# EAGLE design Adafruit MLX90393 Wide Range Magnetometer (EAGLE 9.2.0)
COMPANY: ADAFRUIT INDUSTRIES; DRAWN: KTOWN; REV: C; YEAR: 2019
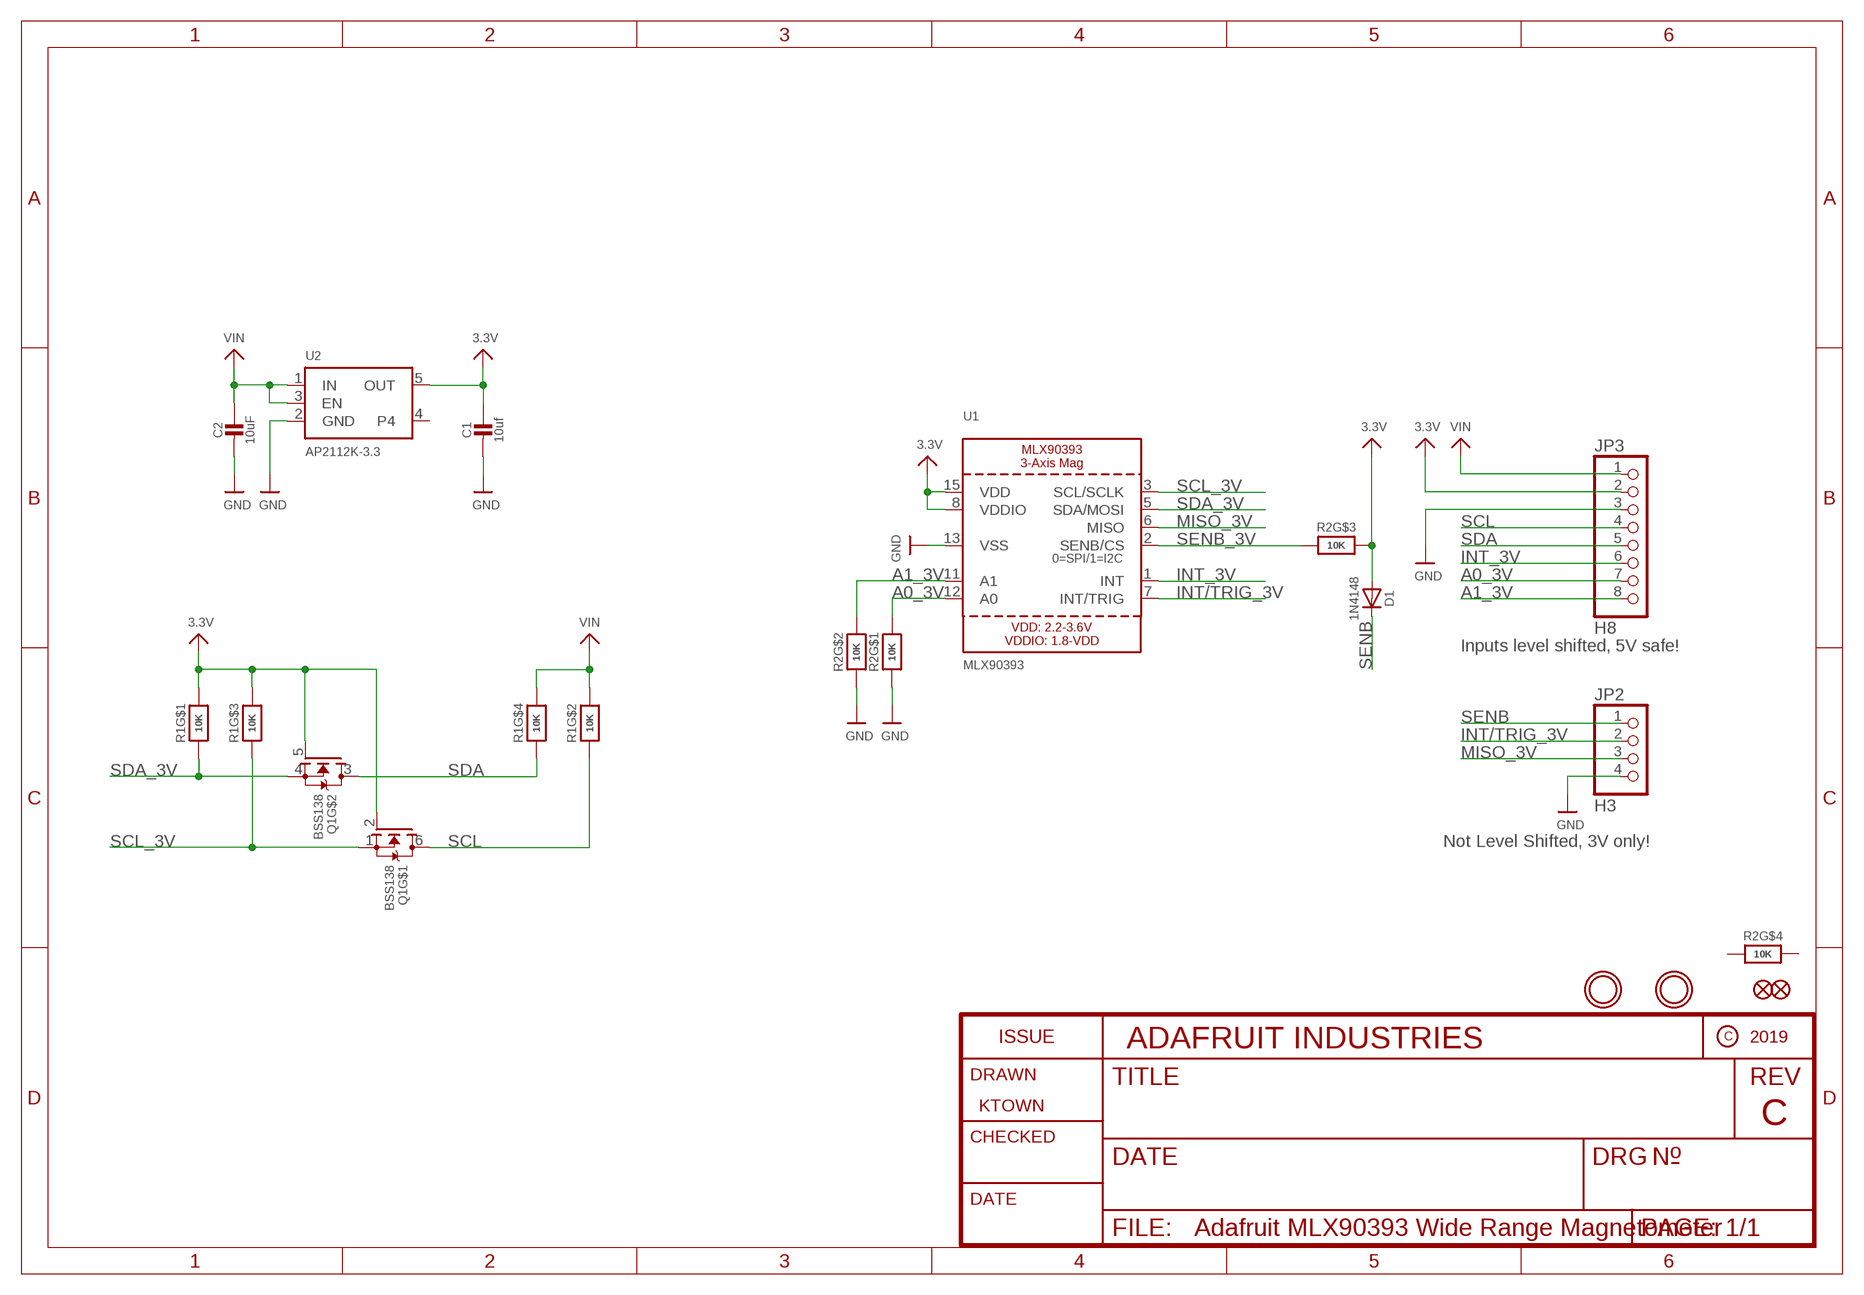
[diagram p0: schematic, sheet 1]

## Parts
C1  10uf  CAP_CERAMIC0805_10MGAP  [0805_10MGAP]
C2  10uF  CAP_CERAMIC0805_10MGAP  [0805_10MGAP]
D1  1N4148  DIODESOD-323  [SOD-323]
FID1  FIDUCIAL_1MM  [FIDUCIAL_1MM]
FID3  FIDUCIAL_1MM  [FIDUCIAL_1MM]
JP2  H3  HEADER-1X4ROUND  [1X04_ROUND]
JP3  H8  HEADER-1X8ROUND  [1X08_ROUND]
Q1  BSS138  MOSFET-N_DUAL  [SOT363]
R1  10K  RESISTOR_4PACK_NO  [RESPACK_4X0603_NO]
R2  10K  RESISTOR_4PACK_NO  [RESPACK_4X0603_NO]
U1  MLX90393  [QFN16_3MM]
U2  AP2112K-3.3  VREG_SOT23-5  [SOT23-5]
U$19  MOUNTINGHOLE2.5  [MOUNTINGHOLE_2.5_PLATED]
U$23  MOUNTINGHOLE2.5  [MOUNTINGHOLE_2.5_PLATED]

## Nets
3.3V: C1.1 D1.A JP3.2 Q1.2(G) Q1.5(G) R1.6 R1.8 R2.6 U1.8(VDDIO) U1.15(VDD) U2.5(OUT)
A0_3V: JP3.7 R2.8 U1.12(A0)
A1_3V: JP3.8 R2.7 U1.11(A1)
GND: C1.2 C2.2 JP2.4 JP3.3 R2.1 R2.2 U1.13(VSS) U2.2(GND)
INT/TRIG_3V: JP2.2 U1.7(INT/TRIG)
INT_3V: JP3.6 U1.1(INT)
MISO_3V: JP2.3 U1.6(MISO)
SCL: JP3.4 Q1.6(D) R1.2
SCL_3V: Q1.1(S) R1.3 U1.3(SCL/SCLK)
SDA: JP3.5 Q1.3(D) R1.4
SDA_3V: Q1.4(S) R1.1 U1.5(SDA/MOSI)
SENB: D1.C JP2.1
SENB_3V: R2.3 U1.2(SENB/CS)
VIN: C2.1 JP3.1 R1.5 R1.7 U2.1(IN) U2.3(EN)
Unconnected: R2.4 R2.5 U2.4

## Notes on the sheet
- Inputs level shifted, 5V safe!
- Not Level Shifted, 3V only!

## Library data of the parts
C1 C2 = microbuilder:CAP_CERAMIC: Ceramic Capacitors For new designs, use the packages preceded by an '_' character since they are more reliable: The following footprints should be used on most boards: _0402 - Standard footprint for regular board layouts _0603 - Standard footprint for regular board layouts _0805 - Standard footprint for regular board layouts _1206 - Standard footprint for regular board layouts For extremely tight-pitch boards where space is at a premium, the following 'micro-pitch' footprints can be used (smaller pads, no silkscreen outline, etc.): _0402MP - Micro-pitch footprint for very dense/compact boards _0603MP - Micro-pitch footprint for very dense/compact boards _0805MP - Micro-pitch footprint for very dense/compact boards _1206MP - Micro-pitch footprint for very dense/compact boards
D1 = microbuilder:DIODE: Diode SMA Model Volts Amps Type Vf Ir Digikey # Notes SSA34-E3 40V 3A Schottky 480mV @ 3A 200uA @ 40V SSA34-E3/61TGITR-ND CDBA120-G 20V 1A Schottky 500mV @ 1A 500uA @ 20V 641-1014-6-ND REEL MBRA210 10V 2A Schottky 350mV @ 2A 700uA @ 10V MBRA210LT3 SOD-123 Model Volts Amps Type Vf Ir Order # Notes BAT54T1G 30V 200mA Schottky 800mV @ 200mA 2uA @ 25V BAT54T1GOSTR-ND B0530W 30V 500mA Schottky 430mV @ 500mA 130uA @ 30V B0530W-FDICT-ND REEL MBR120 20V 1A Schottky 340mV @ 1A MBR120VLSFT1GOSCT-ND SOD-323 Model Volts Amps Type Vf Ir Order # Notes PMEG2005EJ 20V 500mA Schottky 355mV @ 500mA 568-4110-1-ND ZLLS410 10V 570mA Schottky 380mV @ 570mA ZLLS410CT-ND 1N4148WS 75V 150mA Silicon/Simple 1V 1N4148WSFSCT-ND REEL SOD-523 Model Volts Amps Type Vf Ir Order # Notes BAT54XV2 30V 200mA Schottky 0.8V @ 100mA BAT54XV2CT-ND TB751S 30V 30mA Schottky RB751S-40TE61CT-ND SOT23-R/W (R = Solder Paste/Reflow Ovens, W = Hand-Soldering) Model Volts Amps Type Vf Ir Order # Notes BAT54FILM 40V 300mA Schottky 497-7162-1-ND POWERDI-5 Model Volts Amps Type Vf Ir Order # Notes PDS560 60V 5A Schottky 670mV @ 5A 150uA @ 60V PDS560DICT-ND
FID1 FID3 = microbuilder:FIDUCIAL: Fiducial Alignment Points Various fiducial points for machine vision alignment.; BOM: EXCLUDE
JP2 = microbuilder:HEADER-1X4: PIN HEADER
JP3 = microbuilder:HEADER-1X8: PIN HEADER
Q1 = microbuilder:MOSFET-N_DUAL: Dual N-Channel MOSFET SOT363 (2.0x1.25mm) 2N7002PS - 60V, 320mA [Digikey: 568-5984-1-ND]
R1 R2 = microbuilder:RESISTOR_4PACK: Resistor Packs (4 resistors) 4 x 0603 10K 1/16W - Digikey: YC164J-10KCT-ND
U1 = microbuilder:MLX90393: MLX90393 - Wide Range 3 Axis Magnetometer
U2 = microbuilder:VREG_SOT23-5: SOT23-5 Fixed Voltage Regulators Part Current Out V Out V In V Dropout θJA (°C/W) TJ (°C) Digikey Part No. ADP121 150mA 3.3V 3.4-5.5V 0.09V @ 150mA -- -- ADP121-AUJZ33R7CT-ND ADP121 150mA 3.0V 3.1-5.5V 0.09V @ 150mA -- -- ADP121-AUJZ30R7CT-ND ADP122 300mA 3.3V 3.4-5.5V 0.085V @ 300mA -- -- ADP122AUJZ-3.3-R7CT-ND ADP1712 300mA 3.3V 3.5-5.5V 0.17V @ 300mA -- -- ADP1712AUJZ-3.3-R7TR-ND AP7311 (Low Cost) 150mA 3.3V 3.5-6V 0.15V @ 150mA -- -- AP7311-33WG-7DICT-ND LD39015M18R 150mA 1.8V 1.9V-5.5V 0.08V @ 100mA -- -- 497-6977-1-ND LP2985A-33DBVR 150mA 3.3V 3.3-16V 0.28V @ 150mA 206 150 296-18479-1-ND MCP1824T-3302E/OT 300mA 3.3V 3.5V-6V 0.2V @ 300mA -- -- MCP1824T-3302E/OTCT-ND MIC5205-2.5YM5 TR 150mA 2.5V 2.7-16V 0.165V @ 150mA -- -- 576-1257-2-ND MIC5205-3.0YM5 TR 150mA 3.0V 3.2V-16V 0.165V @ 150mA -- -- 576-1258-2-ND MIC5205-3.3YM5 TR 150mA 3.3V 3.5V-16V 0.165V @ 150mA -- -- 576-1259-2-ND TPS780330220 150mA 3.3V+2.2V 3.6-5.5V 250mV Max -- -- 296-23332-1-ND TDA3663/N1,135 100mA 3.3V 3.5-45V 0.18V @ 50mA -- -- 568-5343-1-ND Max operating temp can be calculated using θJA, TJ (max junction temperature), and power in watts. Set the "Maximum Ambient Temperature" until it reaches TJ ("Max Junction Temperature"), which is the absolute limit for safe use of the regulator: Heat Sink Temperature Calculator <http://www.daycounter.com/Calculators/Heat-Sink-Temperature-Calculator.phtml> For example, With 12V source into a 3.3V LP2985 and a 30mA load, we are dissipating (12V-3.3V) * 0.03A = 0.261W. With a θJA of 206 °C/W, a TJ of 150°C, and 261mW we can safely use the chip without a heat sink up to 75°C (=147.1°C Junction Temperature).
U$19 U$23 = microbuilder:MOUNTINGHOLE: Mounting Hole For #2 screws (0.086"/2.18mm width, 0.094"/2.4mm hole) use 2.5mm; BOM: EXCLUDE

## Board
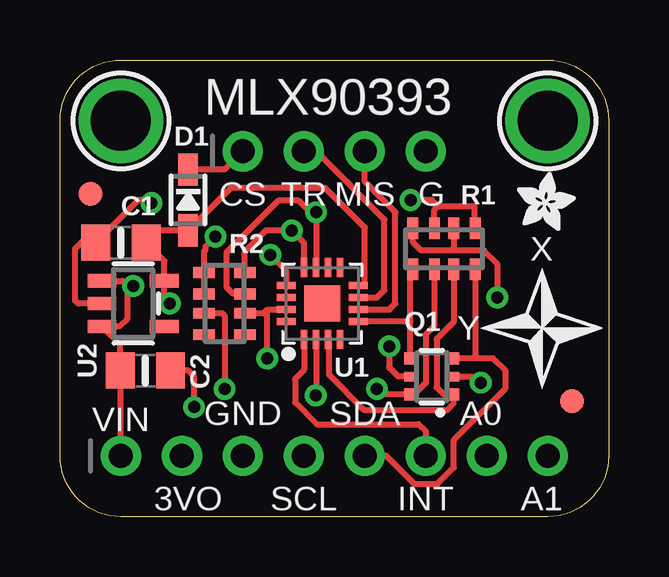
[diagram p1: board, top side]
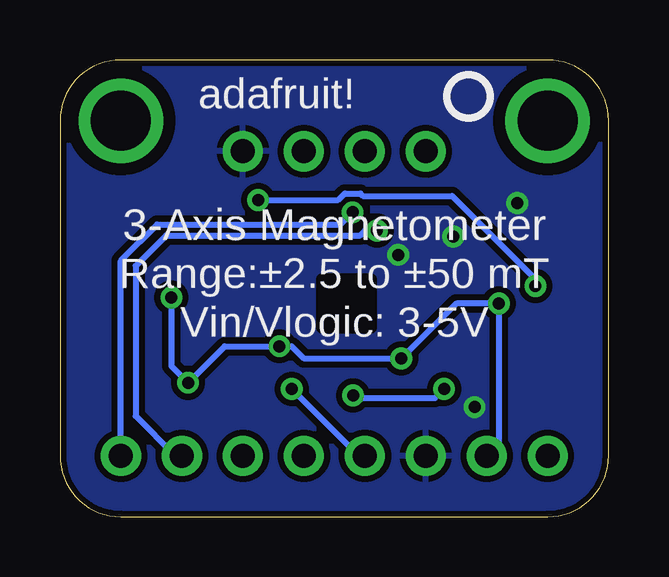
[diagram p2: board, bottom side, seen from below]

Size 22.86 x 19.05 mm. Coordinates in mm from the lower left corner, seen from the top.
Outline: 0,2.54 0,16.51 arc-90 2.54,19.05 20.32,19.05 arc-90 22.86,16.51 22.86,2.54 arc-90 20.32,0 2.54,0 arc-90 0,2.54
Copper layers (1*16): Top 0.035mm / dielectric 1.5mm / Bottom 0.035mm
Design rules "adafruit": minimum track width 8mil, minimum drill 15.5mil, track to track 8mil, track to pad 8mil, pad to pad 8mil, via to via 8mil, smd to smd 8mil, copper to edge 10mil, drill to drill 8mil, minimum pad ring 10mil, minimum via ring 8mil, stop-mask expansion 2mil, vias tented up to drill 20mil, thermal gap 10mil
tRestrict: area 9.9,7.9 to 11.9,9.9
bRestrict: area 9.9,7.9 to 11.9,9.9

### Footprints (pad centres in the part's own frame; a part is rotated, then mirrored left to right if it is on the bottom)
0805_10MGAP = smd 1.2 x 1.5: 1 -1.05,0; 2 1.05,0
SOD-323 = smd 1.35 x 0.8: A 1.27,0; C -1.27,0
FIDUCIAL_1MM = smd 1 x 1: 1 0,0
1X04_ROUND = drill 1 pad 1.676: 1 -3.81,0; 2 -1.27,0; 3 1.27,0; 4 3.81,0
1X08_ROUND = drill 1 pad 1.676: 1 -8.89,0; 2 -6.35,0; 3 -3.81,0; 4 -1.27,0; 5 1.27,0; 6 3.81,0; 7 6.35,0; 8 8.89,0
SOT363 = smd 0.5 x 0.5: 1 -0.75,-0.9; 3 0.75,-0.9; 4 0.75,0.9; 6 -0.75,0.9 | smd 0.4 x 0.5: 2 0,-0.9; 5 0,0.9
RESPACK_4X0603_NO = smd 0.45 x 0.9: 1 -1.3,-0.85; 2 -0.4,-0.85; 3 0.4,-0.85; 4 1.3,-0.85; 5 1.3,0.85; 6 0.4,0.85; 7 -0.4,0.85; 8 -1.3,0.85
QFN16_3MM = smd 0.8 x 0.28: 1 -1.5,0.75; 2 -1.5,0.25; 3 -1.5,-0.25; 4 -1.5,-0.75; 9 1.5,-0.75; 10 1.5,-0.25; 11 1.5,0.25; 12 1.5,0.75 | smd 0.28 x 0.8: 5 -0.75,-1.5; 6 -0.25,-1.5; 7 0.25,-1.5; 8 0.75,-1.5; 13 0.75,1.5; 14 0.25,1.5; 15 -0.25,1.5; 16 -0.75,1.5 | smd 1.5 x 1.5: THERMAL 0,0
SOT23-5 = smd 0.55 x 1.2: 1 -0.95,-1.3; 2 0,-1.3; 3 0.95,-1.3; 4 0.95,1.3; 5 -0.95,1.3
MOUNTINGHOLE_2.5_PLATED = drill 2.5 pad 3.2: P$1 0,0

### Placement (x,y rotation side)
C1  2.54,11.43 180 top
C2  3.56,6.1 0 top
D1  5.33,13.21 270 top
FID1  1.27,13.46 0 top
FID3  21.34,4.83 0 top
JP2  11.43,15.24 0 top
JP3  11.43,2.54 0 top
Q1  15.49,5.84 90 top
R1  16,11.18 0 top
R2  6.86,8.89 270 top
U1  10.92,8.89 90 top
U2  3.05,8.89 270 top
U$3  [SYMBOL_COMPASSXY_5MM]  17.53,5.33 0 top
U$18  [PCBFEAT-REV-040]  5.84,17.53 0 bottom
U$19  2.54,16.51 0 top
U$21  [ADAFRUIT_2.5MM]  19.05,11.94 0 top
U$23  20.32,16.51 0 top

### Tracks (layer width: path | path; a pad name or v marks a point on that pad's centre or on a via)
3.3V  (via drill 0.5)
  Top 0.254: v17.53,5.59 17.41,5.59 17.16,5.84 Q1.2 | U1.8 12.68,9.64 12.7,9.66 12.7,12.06 11.05,13.72 7.11,13.72 D1.A 4.1,11.94 C1.1 4.35,10.67 U2.5 4.35,9.11 v4.57,8.89 | Q1.5 14.1,5.84 13.72,6.22 v13.72,7.11 | R2.6 8.49,8.49 8.64,8.64 | U1.15 8.64,8.64 | v8.64,6.6 8.64,8.64 | R1.8 14.7,11.46 15.06,11.11 16.51,11.11 | v18.22,9.14 18.22,10.55 17.66,11.11 16.51,11.11 | R1.6 16.4,11.21 16.51,11.11
  Bottom 0.254: v18.22,9.14 18.22,6.28 v17.53,5.59 16,7.11 v13.72,7.11 13.21,7.11 12.7,6.6 v8.64,6.6 6.35,8.89 v4.57,8.89 4.57,3.05 JP3.2
A0_3V  (via drill 0.5)
  Top 0.254: R2.8 7.71,11.07 8.58,11.94 v9.65,11.94 10.15,11.44 10.15,10.41 U1.12
  Bottom 0.254: JP3.7 18.05,2.54 19.71,4.2 19.71,10.46 18.44,11.73 10.35,11.73 10.14,11.94 v9.65,11.94
A1_3V  (via drill 0.5)
  Top 0.254: R2.7 7.22,9.29 6.93,9.58 6.93,11.01 9.1,13.18 9.95,13.18 10.43,12.7 v10.67,12.7 U1.11
  Bottom 0.254: v10.67,12.7 11.18,12.19 18.81,12.19 20.32,10.69 JP3.8
GND  (via drill 0.5)
  Top 0.254: 1.49,11.21 C1.2 | v3.81,13.08 3.81,13.21 3.27,13.21 C1.2 | v6.48,11.68 6.06,11.27 6.06,11.13 6.01,11.07 R2.1 R2.2 | v5.59,4.57 5.59,5.84 5.33,6.1 C2.2 | v8.76,10.92 9.42,10.26 U1.13 | U2.2 0.76,8.89 0.64,9.02 0.64,11.18 1.02,11.56 1.14,11.43 C1.2
  pour Bottom (isolate 0.254): 0,2.54 0,16.51 arc-90 2.54,19.05 20.32,19.05 arc-90 22.86,16.51 22.86,2.54 arc-90 20.32,0 2.54,0 arc-90
INT/TRIG_3V
  Top 0.254: U1.7 13.2,9.14 13.51,9.45 13.51,12.39 10.67,15.24 JP2.2
INT_3V
  Top 0.254: U1.1 10.17,6.12 9.79,5.75 9.79,4.76 10.69,3.86 14.94,3.86 15.24,3.56 JP3.6
MISO_3V
  Top 0.254: U1.6 13.72,8.64 13.97,8.89 13.97,12.7 12.7,13.97 JP2.3
SCL  (via drill 0.5)
  Top 0.254: v13.21,5.33 13.21,5.09 Q1.6 14.76,5.09 15.24,5.57 15.24,7.6 15.6,7.96 R1.2
  Bottom 0.254: v13.21,5.33 10.41,2.54 JP3.4
SCL_3V
  Top 0.254: U1.3 11.2,7.36 11.2,5.93 12.68,4.45 16.13,4.45 16.39,4.71 Q1.1 15.99,5.09 15.7,5.38 15.7,7.41 16.4,8.12 R1.3
SDA
  Top 0.254: Q1.3 16.41,6.6 17.27,6.6 | JP3.5 13.59,2.54 14.76,1.37 15.72,1.37 16.41,2.06 16.41,3.2 18.54,5.33 18.54,6.11 18.05,6.6 17.27,6.6 | R1.4 17.3,6.63 17.27,6.6
SDA_3V
  Top 0.254: 14.59,8.14 U1.5 | Q1.4 14.59,8.14 | 14.59,8.14 14.59,10.22 R1.1
SENB
  Top 0.254: JP2.1 6.86,14.48 D1.C
SENB_3V  (via drill 0.5)
  Top 0.254: U1.2 10.67,5.08 v10.65,5.06 | R2.3 6.75,8.49 6.86,8.38 v6.86,5.33
  Bottom 0.254: v6.86,5.33 7.24,4.95 10.54,4.95 v10.65,5.06
VIN  (via drill 0.5)
  Top 0.254: JP3.1 2.54,6.06 C2.1 2.51,7.18 U2.3 2.48,7.94 2.79,8.26 2.79,9.65 | R1.7 15.6,12.81 15.75,12.95 | 15.75,12.95 17.27,12.95 17.27,12.06 R1.5 | 15.75,12.95 15.49,13.21 v14.61,13.21 | U2.1 2.61,9.84 2.67,9.78 2.79,9.65 | v3.05,9.63 2.82,9.63 2.79,9.65
  Bottom 0.254: v14.61,13.21 11.27,13.21 10.99,13.48 10.34,13.48 10.24,13.38 6.52,13.38 2.92,9.78 3.05,9.65 v3.05,9.63

### Text on the board
tPlace: MLX90393 | CS | TR | MIS | G | X | Y | VIN | GND | SDA | A0 | 3VO | SCL | INT | A1
bPlace: adafruit! | 3-Axis Magnetometer | Range:±2.5 to ±50 mT | Vin/Vlogic: 3-5V